# EAGLE schematic LilyPad SimplePower (EAGLE 7.2.0)
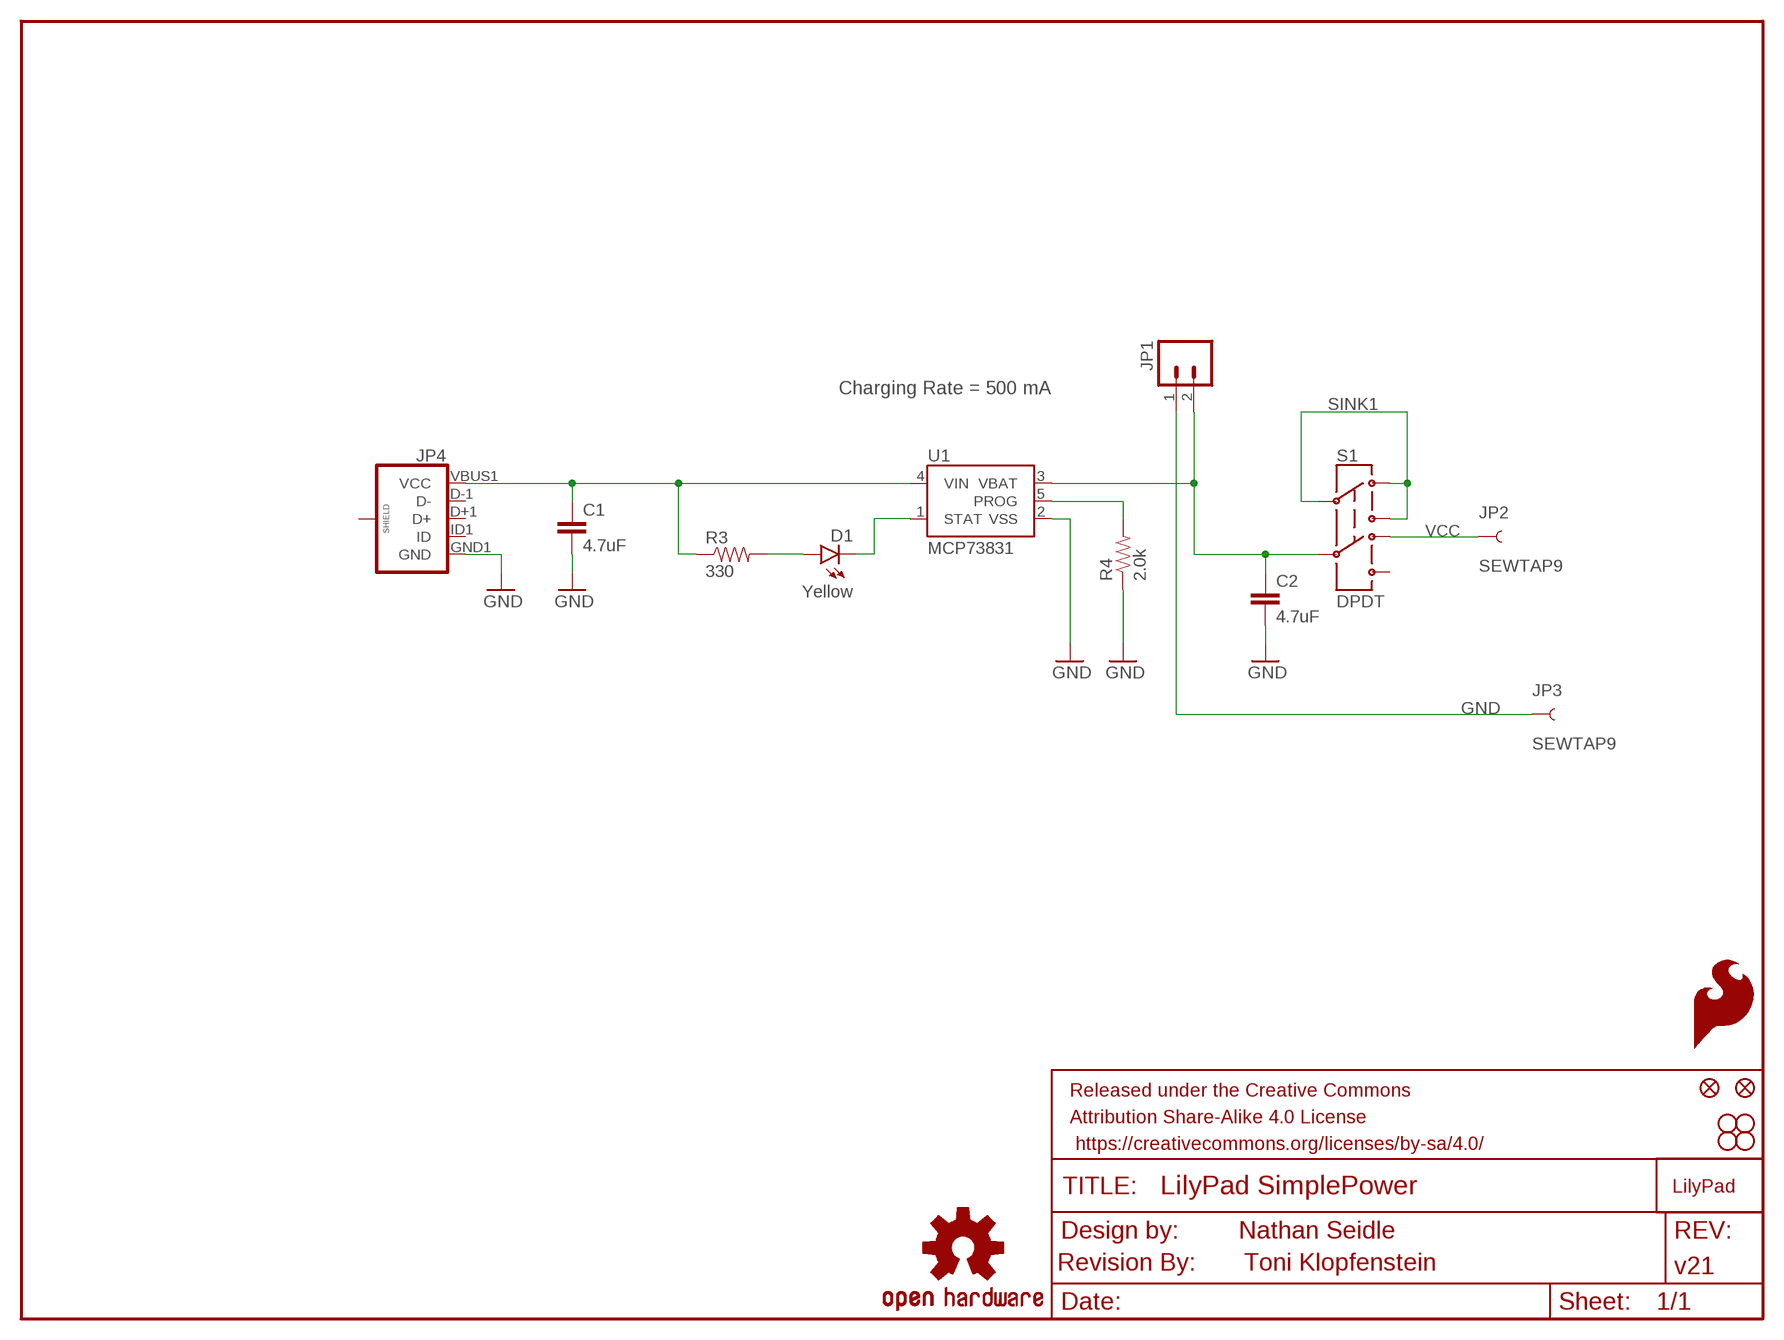
[diagram p0: schematic, sheet 1]

## Parts
C1  4.7uF  4.7UF-6.3V-10%(0603)0603  [0603-CAP]
C2  4.7uF  4.7UF-6.3V-10%(0603)0603  [0603-CAP]
D1  Yellow  LED-YELLOW0603  [LED-0603]
FID1  FIDUCIAL1X2  [FIDUCIAL-1X2]
FID2  FIDUCIAL1X2  [FIDUCIAL-1X2]
FRAME1  FRAME-LETTER  [CREATIVE_COMMONS]
JP1  M02-JST-2MM-SMT  [JST-2-SMD]
JP2  SEWTAP9  [PETAL-LONG-1-2SIDE]
JP3  SEWTAP9  [PETAL-LONG-1-2SIDE]
JP4  USB_MICROB_PLUGCONN-11752  [USB-B-MICRO-SMD_V03]
JP5  SFE_LOGO_FLAME.1_INCH  [SFE_LOGO_FLAME_.1]
R3  330  330OHM1/10W1%(0603)  [0603-RES]
R4  2.0k  2.0KOHM1/10W5%(0603)  [0603-RES]
S1  DPDT  SWITCH-DPDTAYZ0202  [AYZ0202]
STANDOFF1  SEW-HOLE-NO-PAD  [SEW-HOLE-NO-PAD]
STANDOFF2  SEW-HOLE-NO-PAD  [SEW-HOLE-NO-PAD]
STANDOFF3  SEW-HOLE-NO-PAD  [SEW-HOLE-NO-PAD]
STANDOFF4  SEW-HOLE-NO-PAD  [SEW-HOLE-NO-PAD]
U1  MCP73831  [SOT23-5]
U$1  LOGO-LPLP  [LOGO-LILYPAD]
U$5  OSHW-LOGOS  [OSHW-LOGO-S]
U$6  REVISION  [REVISION]

## Nets
GND: C1.2 C2.2 JP1.1 JP3.1 JP4.GND1(GND) R4.1 U1.2(VSS)
N$1: C2.1 JP1.2 S1.5 U1.3(VBAT)
N$3: C1.1 JP4.VBUS1(VCC) R3.1 U1.4(VIN)
N$4: D1.C U1.1(STAT)
N$5: D1.A R3.2
N$7: R4.2 U1.5(PROG)
SINK1: S1.1 S1.2 S1.3
VCC: JP2.1 S1.4
Unconnected: JP4.D+1(D+) JP4.D-1(D-) JP4.ID1(ID) JP4.SHIELD1(SHIELD) JP4.SHIELD2(SHIELD) JP4.SHIELD3(SHIELD) S1.6

## Notes on the sheet
- Charging Rate = 500 mA
- Toni Klopfenstein

## Library data of the parts
C1 C2 = SparkFun-Capacitors:4.7UF-6.3V-10%(0603): CAP-08280; PROD_ID: CAP-08280
D1 = SparkFun-LED:LED-YELLOW: Yellow SMD LEDs LilyPad 1206- DIO-09909 0603- DIO-09003; PROD_ID: DIO-09003
FID1 FID2 = SparkFun-Aesthetics:FIDUCIAL: Fiducial Alignment Points Various fiducial points for machine vision alignment.
FRAME1 = SparkFun-Aesthetics:FRAME-LETTER: Schematic Frame Standard 8.5x11 US Letter frame; DESIGNER: Nathan Seidle; VERSION: v21
JP1 = SparkFun-Connectors:M02: Standard 2-pin 0.1" header. Use with - straight break away headers ( PRT-00116) - right angle break away headers (PRT-00553) - swiss pins (PRT-00743) - machine pins (PRT-00117) - female headers (PRT-00115) Molex polarized connector foot print use with: PRT-08233 with associated crimp pins and housings. 2.54_SCREWTERM for use with PRT-10571. 3.5mm Screw Terminal footprints for PRT-08084 5mm Screw Terminal footprints for use with PRT-08432; PROD_ID: CONN-08352
JP2 JP3 = LilyPad-Wearables:SEWTAP: Sew Taps for LilyPad Boards.
JP4 = SparkFun-Connectors:USB_MICROB_PLUG: USB Micro-B connectors Some male, some female. Watch your step!; PROD_ID: CONN-11752
JP5 = SparkFun-Aesthetics:SFE_LOGO_FLAME: SFE Logo, flame only This is the SparkFun flame logo. The logo on the schematic will always be the same size; the package variant is the height of the flame. Default layer for the logo on the board is tSilk.
R3 = SparkFun-Resistors:330OHM1/10W1%(0603): RES-00818; PROD_ID: RES-00818
R4 = SparkFun-Resistors:2.0KOHM1/10W5%(0603): RES-08296; PROD_ID: RES-08296
S1 = SparkFun-Electromechanical:SWITCH-DPDT: DPDT Version of the COM-00597; PROD_ID: SWCH-08179
STANDOFF1-STANDOFF4 = Local Library:SEW-HOLE-NO-PAD: #4 Stand Off This is the mechanical footprint for a #4 phillips button head screw. Use the keepout ring to avoid running the screw head into surrounding components. SKU : PRT-00447
U1 = SparkFun-PowerIC:MCP73831: Miniature single cell, fully integrated Li-Ion, Li-polymer charge management controller http://ww1.microchip.com/downloads/en/DeviceDoc/21984a.pdf IC-09995; PROD_ID: IC-09995
U$1 = LilyPad-Wearables:LOGO-LP
U$5 = SparkFun-Aesthetics:OSHW-LOGO: Open Source Hardware Logo This logo indicates the piece of hardware it is found on incorporates a OSHW license and/or adheres to the definition of open source hardware found here: http://freedomdefined.org/OSHW
U$6 = SparkFun-Aesthetics:REVISION